# EAGLE design 549-jmaccarl (EAGLE 7.5.0)
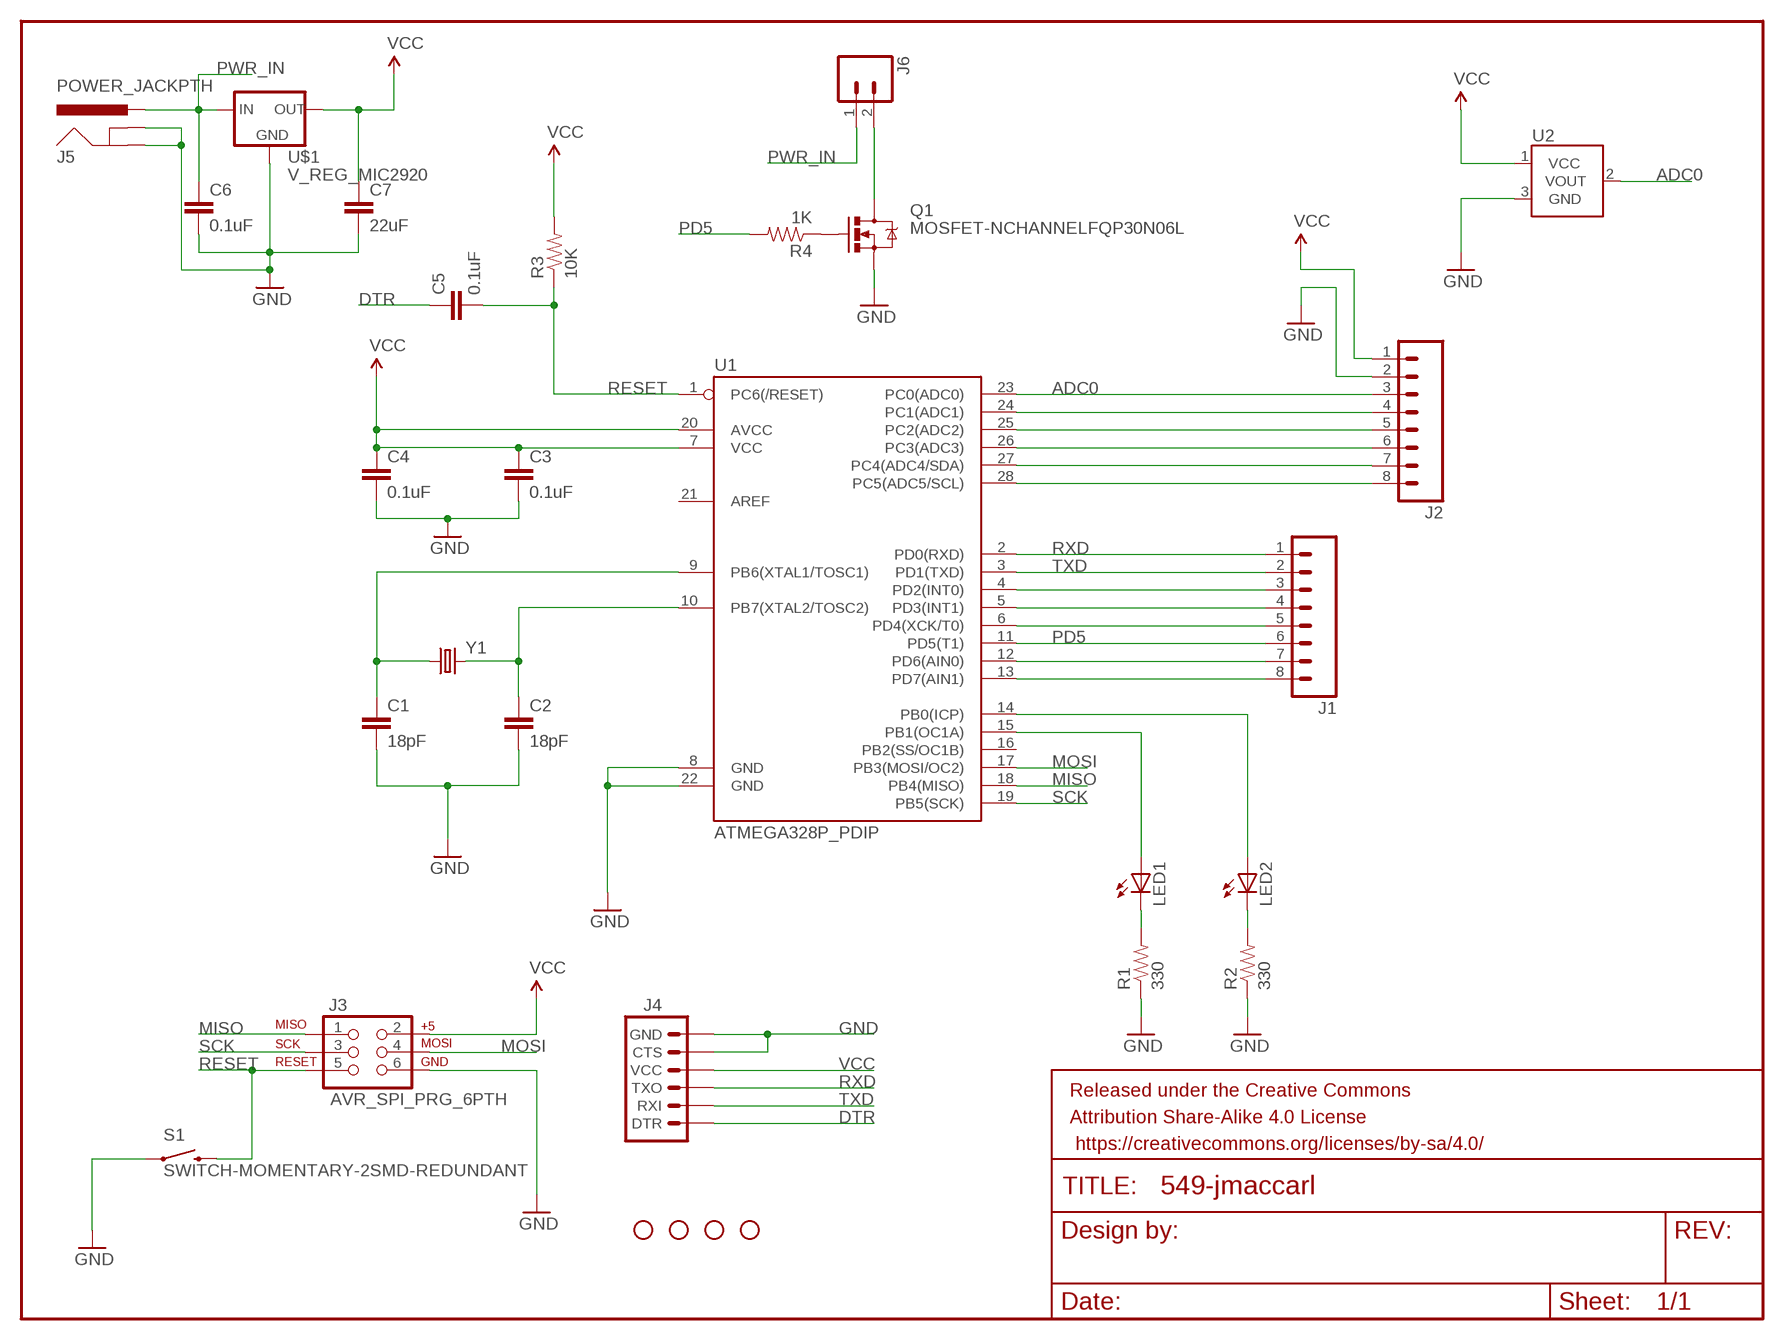
[diagram p0: schematic, sheet 1]

## Parts
C1  18pF  CAP1206  [1206]
C2  18pF  CAP1206  [1206]
C3  0.1uF  CAP1206  [1206]
C4  0.1uF  CAP1206  [1206]
C5  0.1uF  CAP1206  [1206]
C6  0.1uF  CAP1206  [1206]
C7  22uF  CAP1206  [1206]
FRAME1  FRAME-LETTER  [CREATIVE_COMMONS]
H1  STAND-OFF  [STAND-OFF]
H2  STAND-OFF  [STAND-OFF]
H3  STAND-OFF  [STAND-OFF]
H4  STAND-OFF  [STAND-OFF]
J1  M08LOCK  [1X08_LOCK]
J2  M08LOCK  [1X08_LOCK]
J3  AVR_SPI_PRG_6PTH  [2X3]
J4  ARDUINO_SERIAL_PROGRAMPTH  [1X06]
J5  POWER_JACKPTH  [POWER_JACK_PTH]
J6  M025MM  [SCREWTERMINAL-5MM-2]
LED1  LED1206  [LED-1206]
LED2  LED1206  [LED-1206]
Q1  MOSFET-NCHANNELFQP30N06L  [TO220V]
R1  330  RESISTOR1206  [1206]
R2  330  RESISTOR1206  [1206]
R3  10K  RESISTOR1206  [1206]
R4  1K  RESISTOR1206  [1206]
S1  SWITCH-MOMENTARY-2SMD-REDUNDANT  [TACTILE-SWITCH-SMD]
U1  ATMEGA328P_PDIP  [DIL28-3]
U2  TMP36GT9  [TO-92]
U$1  V_REG_MIC2920  [SOT223]
Y1  CRYSTALTXC-7A  [CRYSTAL-TXC-7A]

## Nets
ADC0: J2.3 U1.23(PC0(ADC0)) U2.2(VOUT)
DTR: C5.1 J4.1(DTR)
GND: C1.2 C2.2 C3.2 C4.2 C6.2 C7.2 J2.2 J3.6 J4.5(CTS) J4.6(GND) J5.GND J5.GNDBREAK Q1.3(S) R1.1 R2.1 S1.1 S1.2 U1.8(GND) U1.22(GND) U2.3(GND) U$1.2(GND)
MISO: J3.1 U1.18(PB4(MISO))
MOSI: J3.4 U1.17(PB3(MOSI/OC2))
N$1: LED1.A U1.15(PB1(OC1A))
N$2: LED1.C R1.2
N$3: LED2.A U1.14(PB0(ICP))
N$4: LED2.C R2.2
N$5: J1.8 U1.13(PD7(AIN1))
N$6: J1.7 U1.12(PD6(AIN0))
N$7: J6.2 Q1.2(D)
N$8: J1.5 U1.6(PD4(XCK/T0))
N$9: J1.4 U1.5(PD3(INT1))
N$10: J1.3 U1.4(PD2(INT0))
N$11: Q1.1(G) R4.1
N$13: J2.8 U1.28(PC5(ADC5/SCL))
N$14: J2.7 U1.27(PC4(ADC4/SDA))
N$15: J2.6 U1.26(PC3(ADC3))
N$16: J2.5 U1.25(PC2(ADC2))
N$17: J2.4 U1.24(PC1(ADC1))
N$23: C2.1 U1.10(PB7(XTAL2/TOSC2)) Y1.P$2
N$24: C1.1 U1.9(PB6(XTAL1/TOSC1)) Y1.P$1
PD5: J1.6 R4.2 U1.11(PD5(T1))
PWR_IN: C6.1 J5.PWR J6.1 U$1.1(IN)
RESET: C5.2 J3.5 R3.1 S1.3 S1.4 U1.1(PC6(/RESET))
RXD: J1.1 J4.3(TXO) U1.2(PD0(RXD))
SCK: J3.3 U1.19(PB5(SCK))
TXD: J1.2 J4.2(RXI) U1.3(PD1(TXD))
VCC: C3.1 C4.1 C7.1 J2.1 J3.2 J4.4(VCC) R3.2 U1.7(VCC) U1.20(AVCC) U2.1(VCC) U$1.3(OUT)
Unconnected: U1.16(PB2(SS/OC1B)) U1.21(AREF)

## Library data of the parts
C1-C7 = SparkFun-Capacitors:CAP: Capacitor Standard 0603 ceramic capacitor, and 0.1" leaded capacitor.
FRAME1 = SparkFun-Aesthetics:FRAME-LETTER: Schematic Frame Standard 8.5x11 US Letter frame
H1-H4 = SparkFun-Electromechanical:STAND-OFF: #4 Stand Off This is the mechanical footprint for a #4 phillips button head screw. Use the keepout ring to avoid running the screw head into surrounding components. SKU : PRT-00447
J1 J2 = SparkFun-Connectors:M08: Header 8 Standard 8-pin 0.1" header. Use with straight break away headers (SKU : PRT-00116), right angle break away headers (PRT-00553), swiss pins (PRT-00743), machine pins (PRT-00117), and female headers (PRT-00115).
J3 = SparkFun-Connectors:AVR_SPI_PRG_6: AVR ISP 6 Pin This is the reduced ISP connector for AVR programming. Common on Arduino. This footprint will take up less PCB space and can be used with a 10-pin to 6-pin adapter such as SKU: BOB-08508 **Special note about "TEST_POINT" package. The stop mask is on the top side, so if you want your programming test points to be on the bottom of your board, make sure to place this package on the bottom side of the board. This also ensure that the orientation to program from the bottom side will be correct.
J4 = SparkFun-Connectors:ARDUINO_SERIAL_PROGRAM: FTDI connector footprints
J5 = SparkFun-Connectors:POWER_JACK: Power Jack This is the standard 5.5mm barrel jack for power. The PTH is the most common, proven, reliable, footprint. The Slot footprint only works if the mill layer is transmitted to the PCB fab house so be warned. Mating wall wart : TOL-00298 (and others); PROD_ID: CONN-08197
J6 = SparkFun-Connectors:M02: Standard 2-pin 0.1" header. Use with - straight break away headers ( PRT-00116) - right angle break away headers (PRT-00553) - swiss pins (PRT-00743) - machine pins (PRT-00117) - female headers (PRT-00115) Molex polarized connector foot print use with: PRT-08233 with associated crimp pins and housings. 2.54_SCREWTERM for use with PRT-10571. 3.5mm Screw Terminal footprints for PRT-08084 5mm Screw Terminal footprints for use with PRT-08432; STOREFRONT_ID: PRT-08432
LED1 LED2 = LilyPad-Wearables:LED: LEDs Standard schematic elements and footprints for 5mm, 3mm, 1206, and 0603 sized LEDs. 5mm - Spark Fun Electronics SKU : Comp-SBL
Q1 = SparkFun-DiscreteSemi:MOSFET-NCHANNEL: Common NMOSFET Parts MFG P/N Store ID Prod ID FDD8780 TRANS-09984 SI7820DN TRANS-11055 FDS6630A IC-08089 2N7002PW TRANS-11151 FQP30N06L COM-10213 TRANS-10060 BSS123LT1G TRANS-08345 BSS138 TRANS-00830 BS170 2N7000; PROD_ID: TRANS-10060
R1-R4 = SparkFun-Passives:RESISTOR: Resistor Basic schematic elements and footprints for 0603, 1206, and PTH resistors.
S1 = SparkFun-Electromechanical:SWITCH-MOMENTARY-2: Various NO switches- pushbuttons, reed, etc; PROD_ID: SWCH-08247
U1 = SparkFun-DigitalIC:ATMEGA328P_PDIP: uC used in the Arduino 32kb flash, 1k EEPROM, 2k SRAM This is the through-hole version of this chip.
U2 = SparkFun-Sensors:TMP36: Precision degC temp sensor, analog out
U$1 = SparkFun-PowerIC:V_REG_MIC2920: MIC2920A (http://www.micrel.com/_PDF/mic2920.pdf) - 400mA output LDO Regulator
Y1 = SparkFun-FreqCtrl:CRYSTAL: Various standard crystals. Proven footprints.

## Board
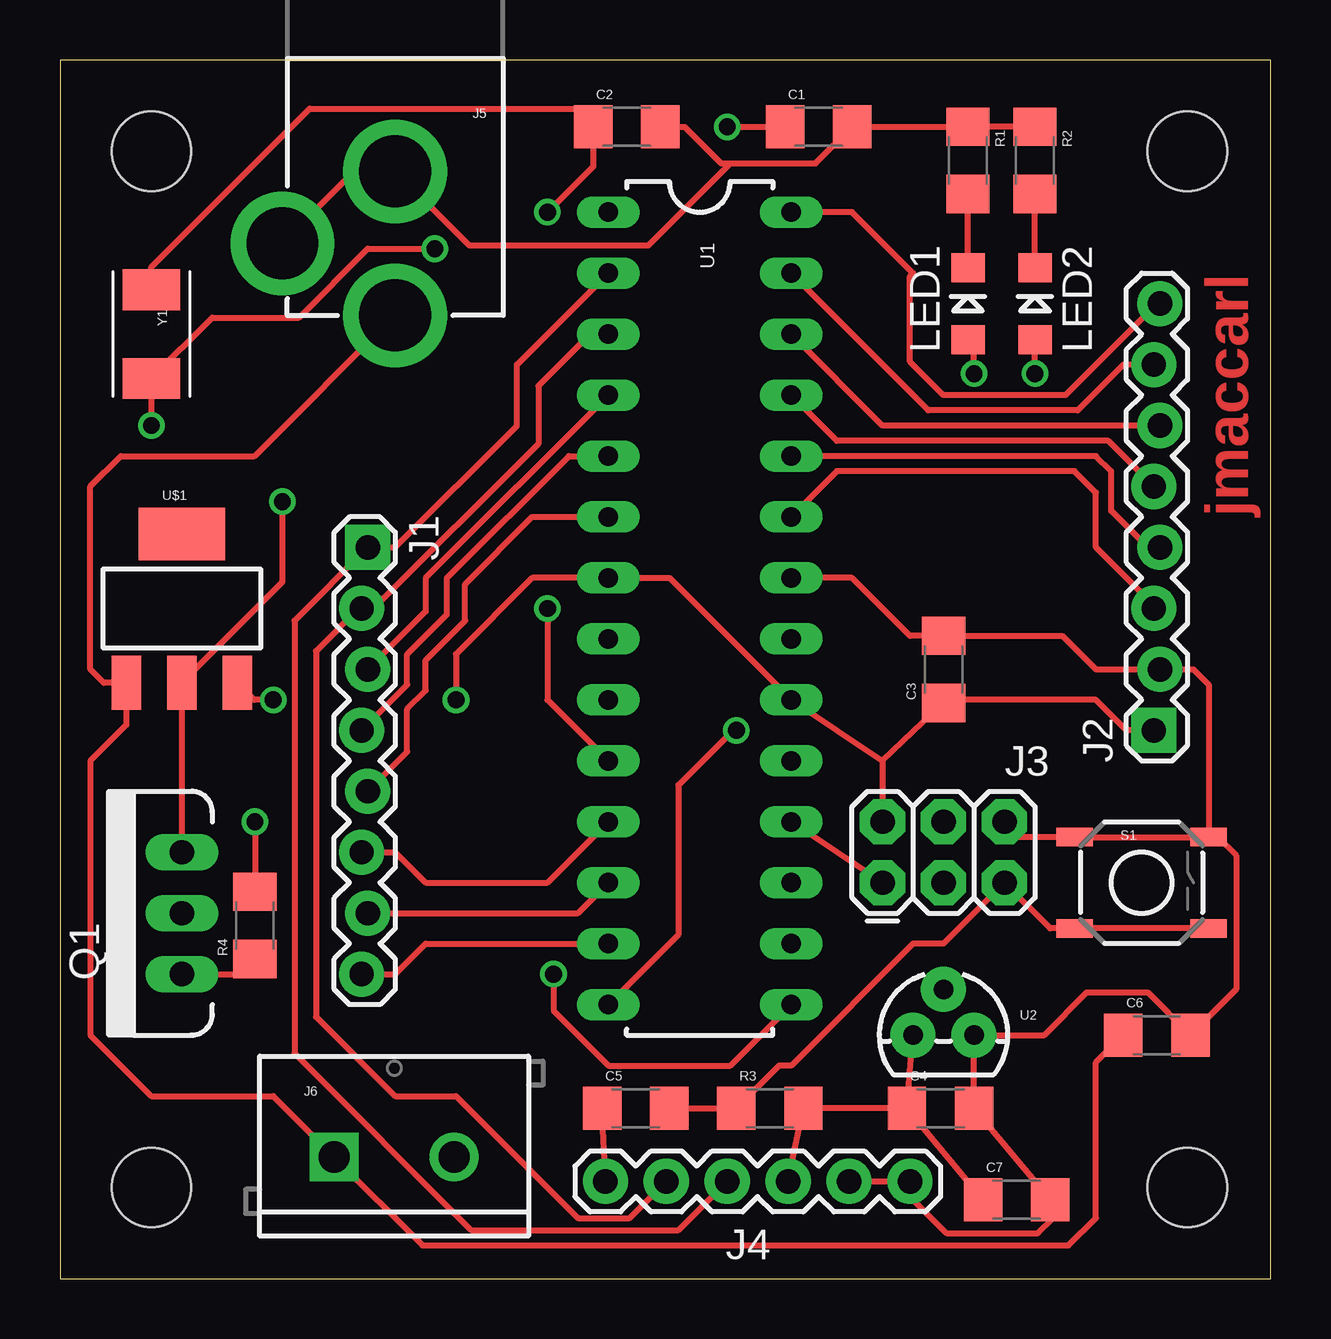
[diagram p1: board, top side]
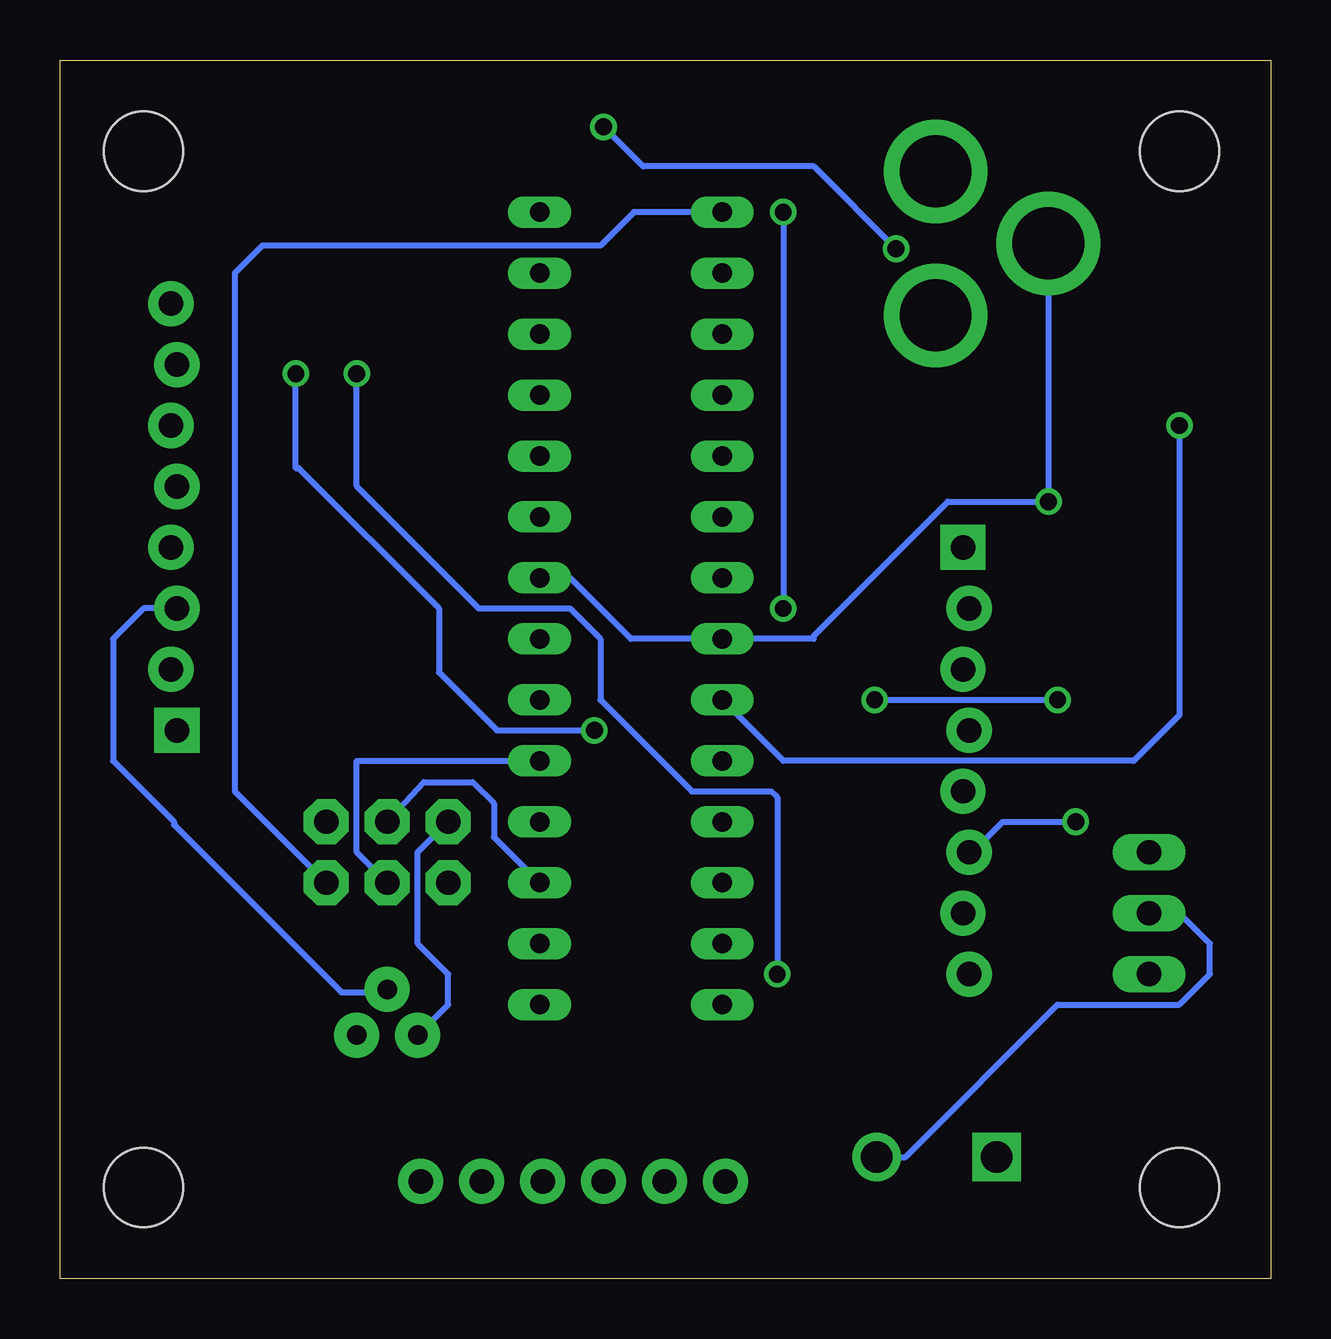
[diagram p2: board, bottom side, seen from below]

Size 50.47 x 50.79 mm. Coordinates in mm from the lower left corner, seen from the top.
Outline: 0,0 50.47,0 50.47,50.79 0,50.79 0,0
Copper layers (1*16): Top 0.035mm / dielectric 1.5mm / Bottom 0.035mm
Design rules "default": minimum track width 10mil, minimum drill 24mil, track to track 8mil, track to pad 8mil, pad to pad 8mil, via to via 8mil, smd to smd 8mil, copper to edge 40mil, drill to drill 8mil, minimum pad ring 10mil, minimum via ring 8mil, stop-mask expansion 4mil, vias tented up to drill 0mil, thermal gap 10mil

### Footprints (pad centres in the part's own frame; a part is rotated, then mirrored left to right if it is on the bottom)
1206 = smd 1.6 x 1.8: 1 -1.4,0; 2 1.4,0
STAND-OFF = hole 3.302: 0,0
1X08_LOCK = drill 1.016 pad 1.88 square: 1 0,0.127 | drill 1.016 pad 1.88: 2 2.54,-0.127; 3 5.08,0.127; 4 7.62,-0.127; 5 10.16,0.127; 6 12.7,-0.127; 7 15.24,0.127; 8 17.78,-0.127
2X3 = drill 1.016 pad 1.88 octagon: 1 0,0; 2 0,2.54; 3 2.54,0; 4 2.54,2.54; 5 5.08,0; 6 5.08,2.54
1X06 = drill 1.016 pad 1.88: 1 0,0; 2 2.54,0; 3 5.08,0; 4 7.62,0; 5 10.16,0; 6 12.7,0
POWER_JACK_PTH = drill 2.997 pad 4.318: GND 0,7.7; GNDBREAK 4.7,10.7; PWR 0,13.7
SCREWTERMINAL-5MM-2 = drill 1.3 pad 2.032 square: 1 0,0 | drill 1.3 pad 2.032: 2 5,0
LED-1206 = smd 1.2 x 1.4: A -1.5,0; C 1.5,0
TO220V = drill 1.016 long: 1 -2.54,0; 2 0,0; 3 2.54,0
TACTILE-SWITCH-SMD = smd 1.524 x 0.762: 1 -2.794,1.905; 2 2.794,1.905; 3 -2.794,-1.905; 4 2.794,-1.905
DIL28-3 = drill 0.813 long: 1 -16.51,-3.81; 2 -13.97,-3.81; 3 -11.43,-3.81; 4 -8.89,-3.81; 5 -6.35,-3.81; 6 -3.81,-3.81; 7 -1.27,-3.81; 8 1.27,-3.81; 9 3.81,-3.81; 10 6.35,-3.81; 11 8.89,-3.81; 12 11.43,-3.81; 13 13.97,-3.81; 14 16.51,-3.81; 15 16.51,3.81; 16 13.97,3.81; 17 11.43,3.81; 18 8.89,3.81; 19 6.35,3.81; 20 3.81,3.81; 21 1.27,3.81; 22 -1.27,3.81; 23 -3.81,3.81; 24 -6.35,3.81; 25 -8.89,3.81; 26 -11.43,3.81; 27 -13.97,3.81; 28 -16.51,3.81
TO-92 = drill 0.813 pad 1.88: 1 -1.27,0; 2 0,1.905; 3 1.27,0
SOT223 = smd 1.219 x 2.235: 1 -2.311,-3.099; 2 0,-3.099; 3 2.311,-3.099 | smd 3.6 x 2.2: 4 0,3.099
CRYSTAL-TXC-7A = smd 1.7 x 2.4: P$1 1.85,0; P$2 -1.85,0

### Placement (x,y rotation side)
C1  31.62,48.01 0 top
C2  23.62,48.01 0 top
C3  36.83,25.4 90 top
C4  36.7,7.11 0 top
C5  24,7.11 0 top
C6  45.72,10.16 0 top
C7  39.88,3.3 0 top
FRAME1  -6.35,55.88 0 top  (outside the outline)
H1  3.81,3.81 0 top
H2  46.99,3.81 0 top
H3  46.99,46.99 0 top
H4  3.81,46.99 0 top
J1  12.7,30.48 270 top
J2  45.72,22.86 90 top
J3  34.29,16.51 0 top
J4  22.73,4.06 0 top
J5  13.97,53.85 180 top
J6  11.43,5.08 0 top
LED1  37.85,40.64 90 top
LED2  40.64,40.64 90 top
Q1  5.08,15.24 90 top
R1  37.85,46.61 270 top
R2  40.64,46.61 270 top
R3  29.59,7.11 0 top
R4  8.13,14.73 90 top
S1  45.09,16.51 0 top
U1  26.67,27.94 270 top
U2  36.83,10.16 0 top
U$1  5.08,27.94 0 top
Y1  3.81,39.37 270 top

### Tracks (layer width: path | path; a pad name or v marks a point on that pad's centre or on a via)
ADC0
  Top 0.254: J2.3 45.59,28.07 43.18,30.48 43.18,32.77 42.29,33.66 32.38,33.66 U1.23
  Bottom 0.254: J2.3 46.99,27.94 48.26,26.67 48.26,21.59 45.72,19.05 45.72,18.92 38.73,11.94 36.96,11.94 U2.2
DTR
  Top 0.254: J4.1 C5.1
GND  (via drill 0.7)
  Top 0.254: R2.1 R1.1 C1.2 31.5,46.48 27.94,46.48 | C6.2 47.12,10.42 | Q1.3 U$1.2 9.27,29.03 v9.27,32.38 | S1.1 40.01,18.41 J3.6 | J4.5 J4.6 35.43,3.43 36.96,1.91 40.77,1.91 41.4,2.54 41.4,3.18 C7.2 C4.2 U2.3 41.02,10.16 42.8,11.94 45.34,11.94 C6.2 | U1.22 33.02,29.21 35.43,26.8 C3.2 41.78,26.8 43.18,25.4 J2.2 47.24,25.4 47.88,24.77 S1.2 S1.1 | C2.2 26.04,48.01 27.56,46.48 27.94,46.48 | S1.1 48.26,18.41 49.02,17.65 49.02,12.06 C6.2 | 27.94,46.48 24.51,43.05 17.07,43.05 J5.GND 12.27,46.15 J5.GNDBREAK
  Bottom 0.254: U1.22 29.21,29.21 26.67,26.67 U1.8 19.05,26.67 19.05,26.8 13.46,32.38 v9.27,32.38 J5.GNDBREAK 9.27,43.18
MISO
  Top 0.254: J3.1 U1.18
MOSI
  Bottom 0.254: J3.4 35.31,20.7 33.27,20.7 32.38,19.81 32.38,18.41 U1.17
N$1  (via drill 0.7)
  Top 0.254: v20.57,12.7 20.57,11.18 22.86,8.89 27.94,8.89 U1.15 | v38.1,37.72 38.1,38.89 LED1.A
  Bottom 0.254: v20.57,12.7 20.57,20.07 20.83,20.32 24.13,20.32 27.94,24.13 27.94,26.67 29.21,27.94 33.02,27.94 38.1,33.02 v38.1,37.72
N$2
  Top 0.254: LED1.C R1.2
N$3  (via drill 0.7)
  Top 0.254: v28.19,22.86 28.07,22.86 25.78,20.57 25.78,14.35 U1.14 | v40.64,37.72 LED2.A 40.64,39.37
  Bottom 0.254: U1.14 22.86,11.56 | v28.19,22.86 32.26,22.86 34.67,25.27 34.67,27.94 40.51,33.78 40.64,33.78 v40.64,37.72
N$4
  Top 0.254: LED2.C R2.2
N$5
  Top 0.254: J1.8 13.97,12.7 15.24,13.97 U1.13
N$6
  Top 0.254: J1.7 21.59,15.24 U1.12
N$7
  Bottom 0.254: J6.2 15.24,5.08 8.89,11.43 3.81,11.43 2.54,12.7 2.54,13.97 3.81,15.24 Q1.2
N$8
  Top 0.254: J1.5 14.48,21.97 14.48,23.75 15.24,24.51 15.24,25.78 16.89,27.43 16.89,28.96 19.68,31.75 U1.6 21.97,31.75
N$9
  Top 0.254: J1.4 14.48,24.77 14.48,26.04 16.13,27.69 16.13,29.21 21.21,34.29 U1.5 22.86,34.16
N$10
  Top 0.254: U1.4 15.24,29.21 15.24,27.81 J1.3
N$11
  Top 0.254: Q1.1 7.5,12.7 R4.1
N$13
  Top 0.254: J2.8 45.72,40.64 41.91,36.83 36.83,36.83 35.43,38.23 35.43,41.78 35.56,41.91 33.02,44.45 U1.28
N$14
  Top 0.254: 30.61,41.78 U1.27 36.2,36.2 42.42,36.2 44.32,38.1 J2.7
N$15
  Top 0.254: J2.6 34.29,35.56 U1.26
N$16
  Top 0.254: J2.5 43.69,34.92 32.38,34.92 U1.25
N$17
  Top 0.254: U1.24 43.18,34.29 43.81,33.66 43.81,32 45.34,30.48 J2.4
N$23  (via drill 0.7)
  Top 0.254: C2.1 21.72,48.26 | C2.1 22.22,46.35 v20.32,44.45 | v20.32,27.94 20.32,24.13 U1.10 | Y1.P$2 3.81,42.16 10.41,48.77 21.46,48.77 C2.1
  Bottom 0.254: v20.32,44.45 v20.32,27.94
N$24  (via drill 0.7)
  Top 0.254: v3.81,35.56 Y1.P$1 6.35,40.06 9.96,40.06 12.83,42.93 v15.62,42.93 | v27.81,48.01 C1.1
  Bottom 0.254: v3.81,35.56 3.81,23.5 5.71,21.59 20.32,21.59 U1.9 | v15.62,42.93 19.05,46.35 26.16,46.35 v27.81,48.01
PD5  (via drill 0.7)
  Top 0.254: J1.6 13.97,17.78 15.24,16.51 20.32,16.51 U1.11 | v8.13,19.05 R4.2
  Bottom 0.254: J1.6 12.45,17.78 11.18,19.05 v8.13,19.05
PWR_IN
  Top 0.254: C6.1 43.18,9.02 43.18,2.54 42.04,1.4 15.11,1.4 J6.1 8.89,7.62 3.81,7.62 1.27,10.16 1.27,21.59 2.77,23.09 U$1.1 1.83,24.84 1.27,25.4 1.27,33.02 2.54,34.29 8.11,34.29 J5.PWR
RESET
  Top 0.254: S1.4 S1.3 41.27,14.61 J3.5 36.83,13.97 35.56,13.97 30.48,8.89 29.97,8.89 R3.1 C5.2
  Bottom 0.254: U1.1 26.54,44.45 27.94,43.05 42.04,43.05 43.18,41.91 43.18,20.32 J3.5
RXD
  Top 0.254: U1.2 19.05,38.1 19.05,35.56 13.97,30.48 J1.1 9.78,27.43 9.78,9.4 17.14,2.03 25.78,2.03 J4.3
SCK
  Bottom 0.254: J3.3 38.1,17.78 38.1,21.59 U1.19
TXD
  Top 0.254: U1.3 22.1,39.37 19.94,37.21 19.94,34.8 13.08,27.94 J1.2 12.45,27.94 10.67,26.16 10.67,10.92 13.97,7.62 16.51,7.62 21.59,2.54 23.75,2.54 J4.2
VCC  (via drill 0.7)
  Top 0.254: C7.1 C4.1 | C4.1 R3.2 J4.4 | J2.1 44.45,22.86 43.18,24.13 36.96,24.13 C3.1 34.29,21.59 | C4.1 U2.1 | 34.29,21.59 U1.20 25.4,29.21 U1.7 19.68,29.21 16.51,26.04 v16.51,24.13 | 34.29,21.59 J3.2 | v8.89,24.13 8.1,24.13 U$1.3
  Bottom 0.254: U2.1 34.29,11.43 34.29,12.7 35.56,13.97 35.56,17.78 J3.2 | v16.51,24.13 v8.89,24.13

### Text on the board
Top: jmaccarl